# EAGLE design controller (EAGLE 7.6.0)
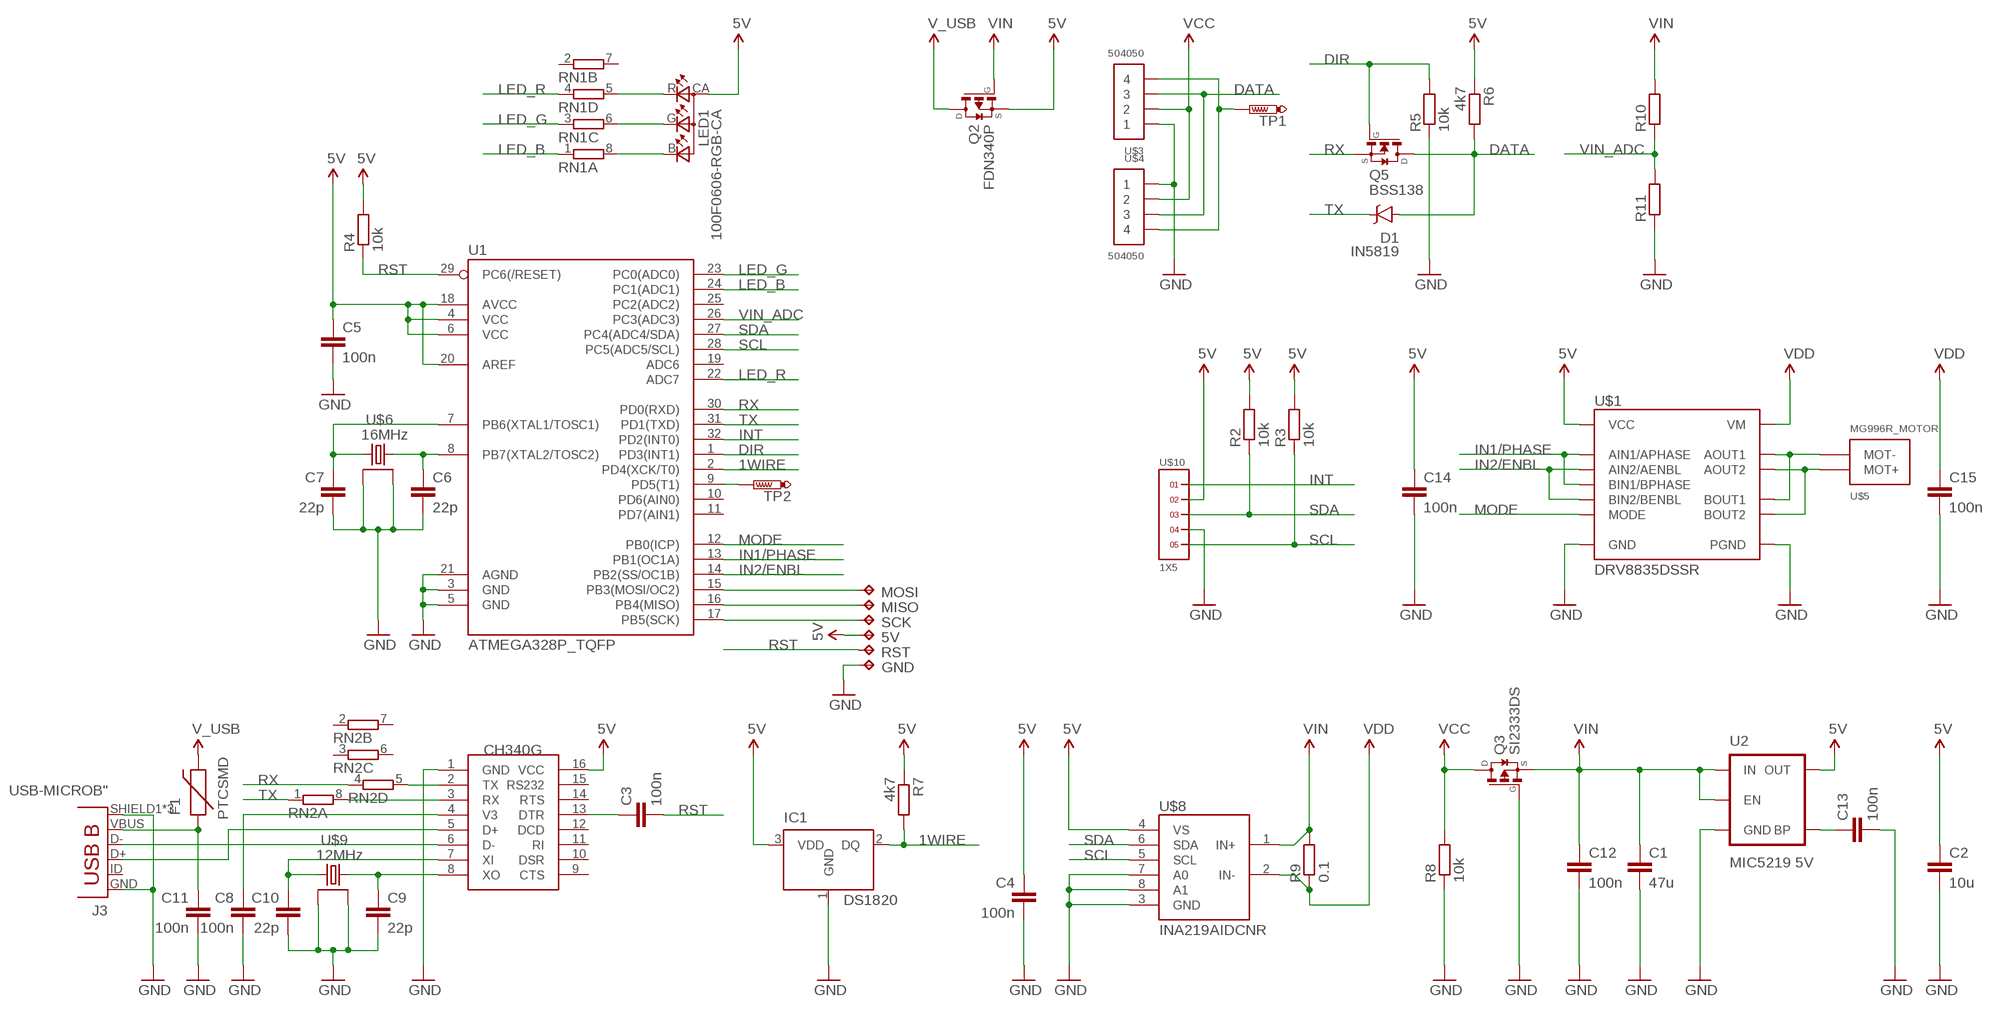
[diagram p0: schematic, sheet 1]

## Parts
5V  TPTP07SQ  [TP07SQ]
C1  47u  C-EUC1206  [C1206]
C2  10u  C-EUC0603K  [C0603K]
C3  100n  C-EUC0402K  [C0402K]
C4  100n  C-EUC0402K  [C0402K]
C5  100n  C-EUC0402K  [C0402K]
C6  22p  C-EUC0402K  [C0402K]
C7  22p  C-EUC0402K  [C0402K]
C8  100n  C-EUC0402K  [C0402K]
C9  22p  C-EUC0402K  [C0402K]
C10  22p  C-EUC0402K  [C0402K]
C11  100n  C-EUC0402K  [C0402K]
C12  100n  C-EUC0402K  [C0402K]
C13  100n  C-EUC0402K  [C0402K]
C14  100n  C-EUC0402K  [C0402K]
C15  100n  C-EUC0402K  [C0402K]
D1  IN5819  MBRA140  [SMA-DIODE]
F1  PTCSMD  [PTC-1206]
GND  TPTP07SQ  [TP07SQ]
IC1  DS1820  [TO-92]
J3  USB-MICROB"  [USB-B-MICRO-SMD_V03]
LED1  100F0606-RGB-CA  [1616]
MISO  TPTP07SQ  [TP07SQ]
MOSI  TPTP07SQ  [TP07SQ]
Q2  FDN340P  [SSOT-3]
Q3  SI2333DS  [SOT23]
Q5  BSS138  [SOT23]
R2  10k  R-EU_R0402  [R0402]
R3  10k  R-EU_R0402  [R0402]
R4  10k  R-EU_R0402  [R0402]
R5  10k  R-EU_R0402  [R0402]
R6  4k7  R-EU_R0402  [R0402]
R7  4k7  R-EU_R0402  [R0402]
R8  10k  R-EU_R0402  [R0402]
R9  0.1  R-EU_R2512  [R2512]
R10  R-EU_R0402  [R0402]
R11  R-EU_R0402  [R0402]
RN1  4R-NYC124  [YC124]
RN2  4R-NYC124  [YC124]
RST  TPTP07SQ  [TP07SQ]
SCK  TPTP07SQ  [TP07SQ]
TP1  PTR1TP12R  [TP12R]
TP2  PTR1TP12R  [TP12R]
U1  ATMEGA328P_TQFP  [TQFP32-08]
U2  MIC5219 5V  V_REG_MIC52195V  [SOT23-5]
U$1  DRV8835DSSR  [WSON-12]
U$2  CH340G  [SOIC16]
U$3  504050  [504050]
U$4  504050  [504050]
U$5  MG996R_MOTOR  [MOTOR]
U$6  16MHz  GSX-331  [OSC3225]
U$8  INA219AIDCNR  [SOT23-8L]
U$9  12MHz  GSX-331  [OSC3225]
U$10  1X5  [1X5]

## Nets
1WIRE: IC1.2(DQ) R7.2 U1.2(PD4(XCK/T0))
5V: 5V.TP C2.1 C4.1 C5.1 C14.1 IC1.3(VDD) LED1.CA Q2.2(S) R2.2 R3.2 R4.2 R6.1 R7.1 U1.4(VCC) U1.6(VCC) U1.18(AVCC) U1.20(AREF) U2.5(OUT) U$1.P$12(VCC) U$2.16(VCC) U$8.4(VS) U$10.2
D+: J3.D+ U$2.5(D+)
D-: J3.D- U$2.6(D-)
DATA: D1.A Q5.3(D) R6.2 U$3.P$3 U$4.P$3
DIR: Q5.1(G) R5.2 U1.1(PD3(INT1))
GND: C1.2 C2.2 C4.2 C5.2 C6.2 C7.2 C8.2 C9.2 C10.2 C11.2 C12.2 C13.2 C14.2 C15.2 GND.TP IC1.1(GND) J3.GND J3.SHIELD1(SHIELD) J3.SHIELD2(SHIELD) J3.SHIELD3(SHIELD) Q3.1(G) R5.1 R8.1 R11.1 U1.3(GND) U1.5(GND) U1.21(AGND) U2.2(GND) U$1.P$6(GND) U$1.P$13(PGND) U$1.P$14(PGND) U$1.P$15(PGND) U$1.P$16(PGND) U$2.1(GND) U$3.P$1 U$4.P$1 U$6.P$2 U$6.P$4 U$8.3(GND) U$8.7(A0) U$8.8(A1) U$9.P$2 U$9.P$4 U$10.4
IN1/PHASE: U1.13(PB1(OC1A)) U$1.P$8(BIN1/BPHASE) U$1.P$10(AIN1/APHASE)
IN2/ENBL: U1.14(PB2(SS/OC1B)) U$1.P$7(BIN2/BENBL) U$1.P$9(AIN2/AENBL)
INT: U1.32(PD2(INT0)) U$10.1
LED_B: RN1.1 U1.24(PC1(ADC1))
LED_B_: LED1.B RN1.8
LED_G: RN1.3 U1.23(PC0(ADC0))
LED_G_: LED1.G RN1.6
LED_R: RN1.4 U1.22(ADC7)
LED_R_: LED1.R RN1.5
MODE: U1.12(PB0(ICP)) U$1.P$11(MODE)
MOT+: U$1.P$2(AOUT1) U$1.P$4(BOUT1) U$5.P$3(MOT-) U$5.P$4(MOT-)
MOT-: U$1.P$3(AOUT2) U$1.P$5(BOUT2) U$5.P$1(MOT+) U$5.P$2(MOT+)
N$1: C6.1 U1.8(PB7(XTAL2/TOSC2)) U$6.P$1
N$2: C7.1 U1.7(PB6(XTAL1/TOSC1)) U$6.P$3
N$3: MOSI.TP U1.15(PB3(MOSI/OC2))
N$4: MISO.TP U1.16(PB4(MISO))
N$5: C3.1 U$2.13(DTR)
N$6: RN2.5 U$2.2(TX)
N$7: TP1.TP U$3.P$4 U$4.P$4
N$8: C10.1 U$2.7(XI) U$9.P$3
N$9: C9.1 U$2.8(XO) U$9.P$1
N$10: C11.1 F1.1 J3.VBUS
N$11: C8.1 U$2.4(V3)
N$12: C13.1 U2.4(BP)
N$13: TP2.TP U1.9(PD5(T1))
N$14: SCK.TP U1.17(PB5(SCK))
N$15: RN2.8 U$2.3(RX)
RST: C3.2 R4.1 RST.TP U1.29(PC6(/RESET))
RX: Q5.2(S) RN2.4 U1.30(PD0(RXD))
SCL: R3.1 U1.28(PC5(ADC5/SCL)) U$8.5(SCL) U$10.5
SDA: R2.1 U1.27(PC4(ADC4/SDA)) U$8.6(SDA) U$10.3
TX: D1.C RN2.1 U1.31(PD1(TXD))
V_USB: F1.2 Q2.3(D)
VCC: Q3.3(D) R8.2 U$3.P$2 U$4.P$2
VDD: C15.1 R9.1 U$1.P$1(VM) U$8.2(IN-)
VIN: C1.1 C12.1 Q2.1(G) Q3.2(S) R9.2 R10.2 U2.1(IN) U2.3(EN) U$8.1(IN+)
VIN_ADC: R10.1 R11.2 U1.26(PC3(ADC3))
Unconnected: J3.ID(USBID) RN1.2 RN1.7 RN2.2 RN2.3 RN2.6 RN2.7 U1.10(PD6(AIN0)) U1.11(PD7(AIN1)) U1.19(ADC6) U1.25(PC2(ADC2)) U$2.9(CTS) U$2.10(DSR) U$2.11(RI) U$2.12(DCD) U$2.14(RTS) U$2.15(RS232)

## Library data of the parts
5V GND MISO MOSI RST SCK = testpad:TP: Test pad
C1-C15 = rcl:C-EU: CAPACITOR, European symbol
D1 = SparkFun-DiscreteSemi:MBRA140: 40V, 1A Schottky rectifier SMA/DO-214AC package DIO-08053; PROD_ID: DIO-08053
F1 = SparkFun-PowerIC:PTC: Resettable Fuse PTC Resettable Fuse. Spark Fun Electronics SKU : COM-08357; PROD_ID: RES-11150
IC1 = DS1820:DS1820: DS1820 - 1-Wire Digital Thermometer
J3 = SparkFun-Connectors:USB-MICROB; PROD_ID: CONN-11752
LED1 = 100F0606-RGB-CA:100F0606-RGB-CA: Common-anode 1616 RGB LED
Q2 = transistor-fet:FDN340P: P-Channel MOSFET Logic Level, PowerTrench MOSFET
Q3 = transistor-fet:SI2333DS: P-Channel MOSFET
Q5 = transistor-fet:BSS138*: Power MOSFET
R2-R11 = rcl:R-EU_: RESISTOR, European symbol
RN1 RN2 = resistor-dil:4R-N: Array Chip Resistor Source: RS Component / Phycomp; OC_FARNELL: unknown; OC_NEWARK: unknown
TP1 TP2 = testpad:PTR1: TEST PIN
U1 = SparkFun-DigitalIC:ATMEGA328P_TQFP; PROD_ID: IC-09069
U2 = SparkFun-PowerIC:V_REG_MIC5219: V_REG MIC5219 Standard 3.3V and 5V 500mA LDO voltage regulator in SOT-23 layout. Micrel part MIC5219. BP (by-pass) pin is used to lower output noise with 470pF cap, may be left open.; PROD_ID: VREG-10107
U$1 = DRV8835:DRV8835DSSR
U$2 = ch340g:CH340G
U$3 U$4 = con-molex-picolock:504050
U$5 = MG996R-Motor:MG996R_MOTOR
U$6 U$9 = crystals_golledge_full_v1-0:GSX-331: Crystal |SM| 3.2 x 2.5 mm | AT cut | Frequency Range 10 - 125 MHz Metal lid can be grounded to minimise EMI Seam sealed for excellent long-term stability Tight specifications available Ultra-miniature for maximum space saving Datasheet <http://www.golledge.com/docs/products/xtl_sm/gsx331.htm?src=eagle>; HEIGHT: 0.8
U$8 = INA219AIDCNR:INA219AIDCNR
U$10 = headers(.05in):1X5

## Board
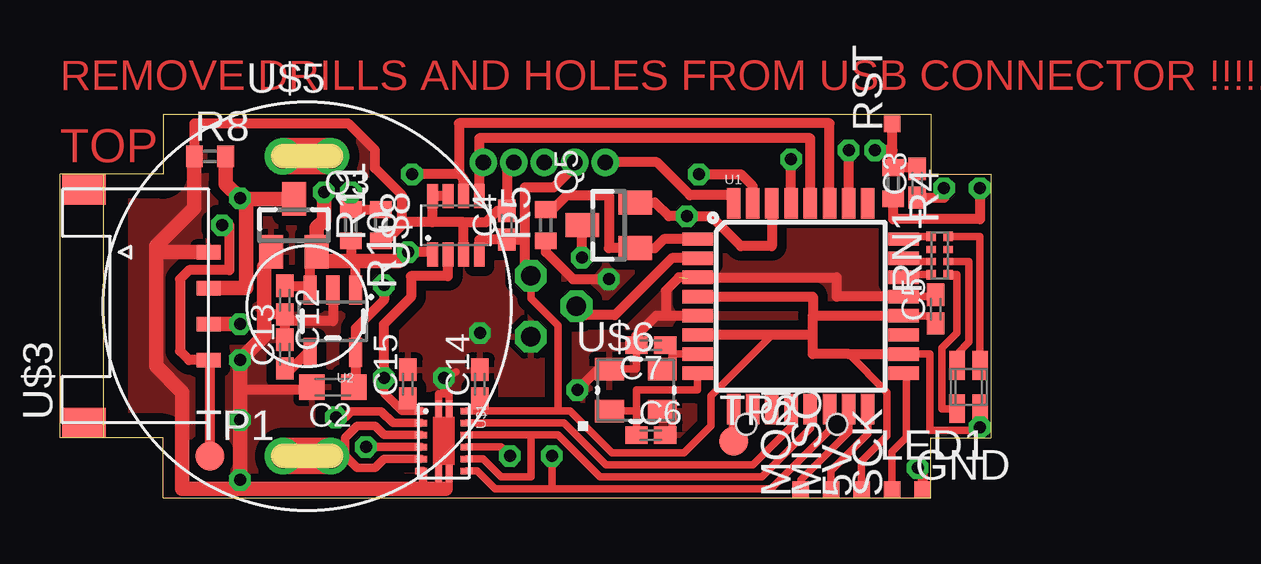
[diagram p1: board, top side]
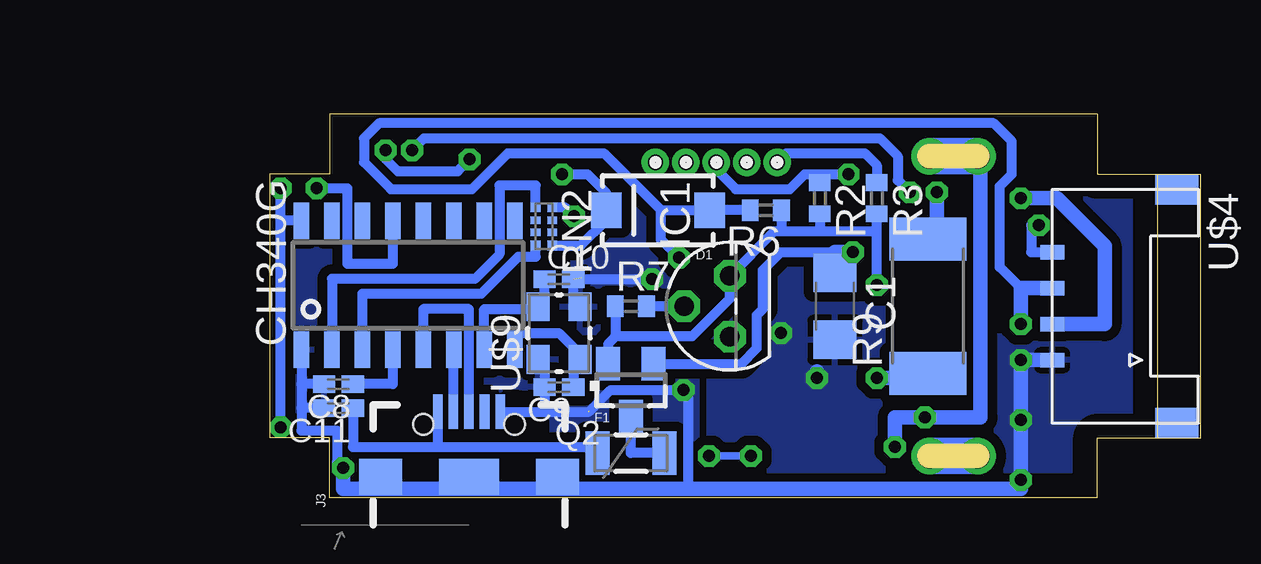
[diagram p2: board, bottom side, seen from below]

Size 38.8 x 16 mm. Coordinates in mm from the lower left corner, seen from the top.
Outline: 1.8,13.5 4.3,13.5 4.3,16 36.3,16 36.3,13.5 38.8,13.5 38.8,2.5 36.3,2.5 36.3,0 4.3,0 4.3,2.5 1.8,2.5
Outline: 1.8,13.5 0,13.5 0,2.5 1.8,2.5
Outline: 1.8,13.5 1.8,2.5
Copper layers (1*16): Top 0.035mm / dielectric 1.5mm / Bottom 0.035mm
Design rules "default": minimum track width 10mil, minimum drill 24mil, track to track 8mil, track to pad 8mil, pad to pad 8mil, via to via 8mil, smd to smd 8mil, copper to edge 40mil, drill to drill 8mil, minimum pad ring 10mil, minimum via ring 8mil, stop-mask expansion 4mil, vias tented up to drill 0mil, thermal gap 10mil

### Footprints (pad centres in the part's own frame; a part is rotated, then mirrored left to right if it is on the bottom)
TP07SQ = smd 0.7 x 0.7: TP 0,0
C1206 = smd 1.6 x 1.8: 1 -1.4,0; 2 1.4,0
C0603K = smd 1.05 x 1.08: 1 -0.875,0; 2 0.875,0
C0402K = smd 0.925 x 0.74: 1 -0.6,0; 2 0.6,0
SMA-DIODE = smd 1.27 x 1.47: A -2.15,0; C 2.15,0
PTC-1206 = smd 1 x 1.8: 1 -1.4,0; 2 1.4,0
TO-92 = drill 0.813 pad 1.27 octagon: 1 -1.27,0; 2 0,1.905; 3 1.27,0
USB-B-MICRO-SMD_V03 = smd 1.45 x 0.4: D+ 2.725,0; D- 2.725,0.65; GND 2.725,-1.3; ID 2.725,-0.65; VBUS 2.725,1.3 | smd 1.5 x 1.8: SHIELD1 0,3.685; SHIELD2 0,-3.685 | smd 1.5 x 2.5: SHIELD3 0,0 | hole 0.85: 2.2,1.9; 2.2,-1.9
1616 = smd 0.65 x 1.2: B -0.475,-0.9; CA -0.475,0.9; G 0.475,-0.9; R 0.475,0.9
SSOT-3 = smd 1 x 1.4: 1 -0.95,-1.1; 2 0.95,-1.1; 3 0,1.1
SOT23 = smd 1 x 1.4: 1 -0.95,-1.1; 2 0.95,-1.1; 3 0,1.1
R0402 = smd 0.7 x 0.9: 1 -0.65,0; 2 0.65,0
R2512 = smd 1.8 x 3.2: 1 -2.8,0; 2 2.8,0
YC124 = smd 0.4 x 0.4: 1 -0.8,-0.35; 4 0.8,-0.35; 5 0.8,0.35; 8 -0.8,0.35 | smd 0.3 x 0.4: 2 -0.25,-0.35; 3 0.25,-0.35; 6 0.25,0.35; 7 -0.25,0.35
TP12R = smd 1.2 x 1.2: TP 0,0
TQFP32-08 = smd 1.27 x 0.559: 1 -4.293,2.8; 2 -4.293,2; 3 -4.293,1.2; 4 -4.293,0.4; 5 -4.293,-0.4; 6 -4.293,-1.2; 7 -4.293,-2; 8 -4.293,-2.8; 17 4.293,-2.8; 18 4.293,-2; 19 4.293,-1.2; 20 4.293,-0.4; 21 4.293,0.4; 22 4.293,1.2; 23 4.293,2; 24 4.293,2.8 | smd 0.559 x 1.27: 9 -2.8,-4.293; 10 -2,-4.293; 11 -1.2,-4.293; 12 -0.4,-4.293; 13 0.4,-4.293; 14 1.2,-4.293; 15 2,-4.293; 16 2.8,-4.293; 25 2.8,4.293; 26 2,4.293; 27 1.2,4.293; 28 0.4,4.293; 29 -0.4,4.293; 30 -1.2,4.293; 31 -2,4.293; 32 -2.8,4.293
SOT23-5 = smd 0.55 x 1.2: 1 -0.95,-1.3; 2 0,-1.3; 3 0.95,-1.3; 4 0.95,1.3; 5 -0.95,1.3
WSON-12 = smd 0.28 x 0.5: P$1 -1.25,-0.95; P$2 -0.75,-0.95; P$3 -0.25,-0.95; P$4 0.25,-0.95; P$5 0.75,-0.95; P$6 1.25,-0.95; P$7 1.25,0.95; P$8 0.75,0.95; P$9 0.25,0.95; P$10 -0.25,0.95; P$11 -0.75,0.95; P$12 -1.25,0.95 | smd 0.7 x 0.25: P$13 -1.35,0.225; P$14 -1.35,-0.225; P$15 1.35,-0.225; P$16 1.35,0.225
SOIC16 = smd 0.635 x 1.524: 1 -4.445,-2.695; 2 -3.175,-2.695; 3 -1.905,-2.695; 4 -0.635,-2.695; 5 0.635,-2.695; 6 1.905,-2.695; 7 3.175,-2.695; 8 4.445,-2.695; 9 4.445,2.695; 10 3.175,2.695; 11 1.905,2.695; 12 0.635,2.695; 13 -0.635,2.695; 14 -1.905,2.695; 15 -3.175,2.695; 16 -4.445,2.695
504050 = smd 0.6 x 1: P$1 2.25,0.01; P$2 0.75,0.01; P$3 -0.75,0.01; P$4 -2.25,0.01 | smd 1.25 x 1.8: P$5 4.855,5.2; P$6 -4.855,5.2
MOTOR = drill 1.016: P$1 1,-6.25; P$2 -1,-6.25; P$3 1,6.25; P$4 -1,6.25
OSC3225 = smd 1.2 x 0.95: P$1 -1.1,-0.875; P$2 1.1,-0.875; P$3 1.1,0.875; P$4 -1.1,0.875
SOT23-8L = smd 0.45 x 1: 1 -0.975,-1.225; 2 -0.325,-1.225; 3 0.325,-1.225; 4 0.975,-1.225; 5 0.975,1.225; 6 0.325,1.225; 7 -0.325,1.225; 8 -0.975,1.225
1X5 = drill 0.635 pad 1.016: 1 0,0; 2 1.27,0; 3 2.54,0; 4 3.81,0; 5 5.08,0

### Placement (x,y rotation side)
5V  33.41,0.35 90 top
C1  15.25,8 270 bottom
C2  11.38,4.62 180 top
C3  35.73,13.12 90 top
C4  18.62,11.38 90 top
C5  36.5,7.88 90 top
C6  24.62,2.62 0 top
C7  24.62,6.38 180 top
C8  35.94,4.75 180 bottom
C9  26.75,4.62 180 bottom
C10  26.75,9.12 0 bottom
C11  35.94,3.75 180 bottom
C12  9.38,8.25 270 top
C13  9.38,6 90 top
C14  17.5,4.75 90 top
C15  14.5,4.75 90 top
D1  22.62,12 180 bottom
F1  23.75,1.88 0 bottom
GND  35.95,0.35 0 top
IC1  19.62,8 90 bottom
J3  30.5,0.88 90 bottom
LED1  37.88,4.62 180 top
MISO  32.15,0.35 90 top
MOSI  30.88,0.35 90 top
Q2  23.75,4.5 180 bottom
Q3  9.75,11.38 0 top
Q5  22.88,11.38 90 top
R2  15.88,12.5 270 bottom
R3  13.5,12.5 270 bottom
R4  34.73,13.12 270 top
R5  20.25,11.38 90 top
R6  18.12,12 180 bottom
R7  23.75,8 0 bottom
R8  6.25,14.25 0 top
R9  11.38,8 90 bottom
R10  12.12,11.38 270 top
R11  13.38,11.38 90 top
RN1  36.66,10.12 270 top
RN2  27.38,11.33 90 bottom
RST  34.69,15.6 90 top
SCK  34.69,0.35 90 top
TP1  6.25,1.75 0 top
TP2  28.07,2.38 0 top
U1  30.88,8 0 top
U2  11.38,7.38 180 top
U$1  16,2.38 270 top
U$2  33.04,8.88 0 bottom
U$3  6.2,8 90 top
U$4  6.2,8 270 bottom
U$5  10.3,8 0 top
U$6  24,4.5 0 top
U$8  16.5,11.38 0 top
U$9  26.75,6.88 90 bottom
U$10  22.73,14 0 bottom

### Tracks (layer width: path | path; a pad name or v marks a point on that pad's centre or on a via)
1WIRE
  Top 0.406: U1.2 25.5,10 23.12,7.62 21.91,7.62 IC1.2
  Bottom 0.406: R7.2 IC1.2
5V  (via drill 0.5)
  Top 0.305: 20.75,3.62 21.25,3.62 23,1.88 26,1.88 27.12,3 27.12,4.25 29.62,6.75 29.62,6.8 | 20.75,3.62 17.5,3.62 | 17.5,3.62 U$1.P$12 | C14.1 17.5,3.62 | 5V.TP 33.41,1.54 34.48,2.6 34.48,4.4 32.88,6 | U1.20 36.5,7.6 C5.1 | U1.18 36.25,6 36.25,2.81 38.2,2.81 v38.34,2.96 LED1.CA | IC1.3 19.62,8.31 20.75,7.19 20.75,3.62
  Top 0.406: C2.1 12.32,4.62 U2.5 12.32,7.08 13.5,8.25 v13.5,8.88 | 19.38,10.78 C4.1 17.48,10.78 U$8.4 | v38.34,12.92 38.34,11.62 34.73,11.62 R4.2 | IC1.3 19.38,9.52 19.38,10.78 | U1.4 31.38,8.4 31.38,7.6 | U1.20 31.38,7.6 | 31.38,6.8 31.38,6 32.88,6 U1.18 | 31.38,6.8 31.38,7.6 | 31.38,6.8 29.62,6.8 U1.6 | U$10.2 21.46,13.84 20.59,12.96 19.38,12.96 19.38,10.78
  Bottom 0.406: 17.48,11.12 17.77,11.12 IC1.3 | 17.48,11.12 15.88,11.12 | 15.88,11.12 13.5,11.12 | v13.5,8.88 13.5,11.12 | R2.2 15.88,11.12 | 13.5,11.12 R3.2 | 19.64,9.25 IC1.3 | v38.34,2.96 38.34,11.57 | 38.34,11.57 v38.34,12.92 | Q2.2 24.7,6.42 24.38,6.75 | U$2.16 38.34,11.57 | 24.38,6.75 21.19,6.75 19.62,8.31 IC1.3 | R7.1 24.4,6.78 24.38,6.75 | R6.1 17.48,11.12
D+
  Bottom 0.406: J3.D+ 30.5,7.88 32.41,7.88 U$2.5
D-
  Bottom 0.406: J3.D- 31.15,5.68 U$2.6
DATA  (via drill 0.5)
  Top 0.406: v21.75,10.03 21.75,11.38 Q5.3
  Top 0.61: v7.5,7.25 U$3.P$3
  Bottom 0.406: 7.5,8.75 8.38,9.62 8.38,13 7.88,13.5 7.88,14.88 8.62,15.62 34.25,15.62 34.88,15 34.88,14 33.75,12.88 30.38,12.88 28.88,14.38 24.88,14.38 22.5,12 | 20.75,12 D1.A | 22.5,12 D1.A | R6.2 D1.A | v21.75,10.03 22.5,10.78 22.5,12
  Bottom 0.61: U$4.P$3 7.5,8.75 v7.5,7.25 7.62,7.25
DIR
  Top 0.406: R5.2 20.52,12.03 21.12,12.62 22.88,12.62 22.88,10.43 Q5.1 24.8,10.43 25.18,10.8 U1.1
GND  (via drill 0.5)  (2 unrouted)
  Top 0.305: U$1.P$15 U$1.P$14 15.78,4.35 16,4.35 | U$1.P$16 U$1.P$13 16.23,4.35 16,4.35 | 16,4.35 v16,5 16.5,5.25 | U$1.P$15 15.78,0.38 16.06,0.38 16.23,0.38 16.23,1 | 15.78,1.12 U$1.P$15 | U1.21 36.5,8.4 C5.2 | U$6.P$2 25.5,3.62 25.5,2.62 C6.2 | C7.2 24.02,5.38 U$6.P$4
  Top 0.35: U$1.P$6 15.12,1.12 15.12,0.38
  Top 0.406: R8.1 5.6,15.62 12,15.62 13.12,14.5 13.12,13.75 14.25,12.62 14.25,11.5 | U$8.3 16.82,11.5 | U$8.7 U$8.8 15.53,11.5 | 16.82,11.5 17.75,11.5 18.23,11.97 C4.2 18.62,13.71 U$10.4 | U2.2 11.38,7.38 9.38,7.38 C12.2 | C13.2 C12.2 | C2.2 10.5,4.5 7.5,4.5 v7.5,3.25 | v35.75,1.25 35.95,1.25 GND.TP | C12.2 8.5,7.65 | 16.82,11.5 15.53,11.5 | 15.53,11.5 14.25,11.5 | U1.21 32.38,8.4 32.38,9.2 U1.3 25.8,9.2 25.25,8.65 25.25,7.6 | v21.56,4.5 22.44,5.38 U$6.P$4 | U1.5 25.25,7.6 | 25.25,7.6 24.85,7.6 24.02,6.78 C7.2 | R5.1 20.25,10.25 21.38,9.12 v22.88,9.12 | R11.1 13.6,10.72 14.25,11.38 14.25,11.5
  Top 0.61: 4,10.25 4,5.5 5.1,4.4 5.1,0.38 7.5,0.38 | Q3.1 8.8,9.95 8.5,9.65 8.5,7.65 8.5,6.75 v7.5,5.75 v7.5,3.25 7.5,0.38 | 7.5,0.38 15.12,0.38 16.06,0.38 | U$3.P$1 4,10.25 | 4,10.25 4,10.5 5.6,12.1 R8.1
  Bottom 0.406: 21.38,0.38 21.38,4.5 v21.56,4.5 24.6,4.5 25.5,3.6 27.38,3.6 | U$2.1 37.48,4.75 | 37.48,3.75 37.48,2.81 36,2.81 36,1.5 v35.75,1.25 | U$9.P$4 27.35,5.5 C9.2 27.35,3.62 27.38,3.6 | U$9.P$2 26.15,8.25 C10.2 v22.88,9.12 | J3.GND 27.38,3.6 | C8.2 37.48,4.75 | 37.48,4.75 37.48,3.75 | C11.2 37.48,3.75
  Bottom 0.61: U$4.P$1 v7.5,5.75 v7.5,3.25 v7.5,0.75 7.5,0.38 21.38,0.38 27,0.38 | 16,5.28 v16,5 | v35.75,1.25 35.75,0.38 34.5,0.38 | 34.5,0.38 30.75,0.38 | 30.75,0.38 27,0.38 | J3.SHIELD2 26.94,0.43 27,0.38 | J3.SHIELD3 30.62,0.5 30.75,0.38 | J3.SHIELD1 34.31,0.56 34.5,0.38
  other vias: 17.5,6.88
  pour Bottom (isolate 0.406): 13.25,0 13.25,10 20.5,10 20.5,0
  pour Top (isolate 0.406): 13.25,10 13.25,0 20.5,0 20.5,10
  pour Top (isolate 0.406): 0,16 12.75,16 12.75,0 0,0
  pour Bottom (isolate 0.406): 12.75,0 0,0 0,16 12.75,16
  pour Bottom (isolate 0.406): 21,0 21,16 38.8,16 38.8,0
  pour Top (isolate 0.406): 21,0 38.8,0 38.8,16 21,16
IN1/PHASE
  Top 0.305: U$1.P$10 19.62,2.62 | 19.62,2.62 20.75,2.62 22.5,0.88 29.25,0.88 31.27,2.9 U1.13 | U$1.P$8 17.62,1.62 18.38,0.88 19.62,0.88 19.62,2.62
IN2/ENBL  (via drill 0.5)
  Top 0.305: U$1.P$9 18.38,2.12 v18.75,1.75 | U$1.P$7 17.38,1.12 18.12,0.38 20.5,0.38 | U1.14 32.08,2.83 29.62,0.38 20.5,0.38 | v20.5,1.75 20.5,0.38
  Bottom 0.305: v18.75,1.75 v20.5,1.75
INT
  Top 0.406: U1.32 28.07,12.62 26.25,12.62 24.88,14 U$10.1
LED_B
  Top 0.305: U1.24 35.17,10.91 RN1.1
LED_B_
  Top 0.305: LED1.B 38.35,10.91 RN1.8
LED_G
  Top 0.305: U1.23 35.17,9.87 RN1.3
LED_G_
  Top 0.305: LED1.G 37.4,6 37.88,6.5 37.88,9.87 RN1.6
LED_R
  Top 0.305: U1.22 35.17,9.31 RN1.4
LED_R_
  Top 0.305: LED1.R 36.75,3.73 36.75,6.25 37.38,6.88 37.38,9.31 RN1.5
MODE
  Top 0.305: U$1.P$11 21,3.12 22.75,1.38 28.88,1.38 30.48,2.98 U1.12
MOT+  (via drill 0.5)
  Top 0.35: U$1.P$4 v12.75,2.12 | U$1.P$2 13.88,3.12 13.39,3.61 12.12,3.61 11.88,3.36 v11.5,3.36
  Bottom 0.61: v12.75,2.12 12.75,3.36 v11.5,3.36 9.18,3.36 9.18,14.25 U$5.P$3
MOT-
  Top 0.35: U$1.P$3 13.5,2.62 13.12,3 12.38,3 11.88,2.5 11.88,1.75 | 11.88,1.75 12.38,1.25 13.12,1.25 13.5,1.62 U$1.P$5 | 11.88,1.75 U$5.P$1
N$1
  Top 0.305: C6.1 24.02,3.62 | 24.02,3.62 U$6.P$1 | U1.8 26.58,4.5 24.02,4.5 24.02,3.62
N$2
  Top 0.305: U1.7 25.5,6 | 25.5,6 25.5,6.38 C7.1 | U$6.P$3 25.5,5.38 25.5,6
N$3
  Top 0.305: U1.15 32.88,2.75 30.88,0.75 MOSI.TP
N$4
  Top 0.305: U1.16 33.67,2.67 32.15,1.15 MISO.TP
N$5  (via drill 0.5)
  Top 0.406: C3.1 36.85,12.53 v36.85,12.92
  Bottom 0.406: 33.67,11.8 U$2.13 33.67,9.78 35.58,9.78 35.58,12.92 v36.85,12.92
N$6
  Bottom 0.406: U$2.2 36.22,9.14 30.25,9.14 29.23,10.16 29.23,13.04 27.73,13.04 RN2.5
N$7  (via drill 0.5)
  Top 0.406: v6.75,11.38 7.06,11.38 7.06,9.5 5.38,9.5 5,9.12 5,6.12 5.38,5.75 U$3.P$4 6.25,5.75 TP1.TP
  Bottom 0.406: v6.75,11.38 7.06,11.38 7.06,10.25 U$4.P$4
N$8
  Bottom 0.406: C10.1 27.35,8.25 U$9.P$3 27.62,7.88 29.86,7.88 U$2.7
N$9
  Bottom 0.406: C9.1 26.15,5.5 U$9.P$1 25.88,6 26.75,6.88 28.59,6.88 U$2.8
N$10
  Bottom 0.406: 31.8,2.12 35.34,2.12 C11.1 | 31.8,2.12 25.15,2.12 F1.1 | 31.8,4.12 J3.VBUS 31.8,2.12
N$11
  Bottom 0.406: U$2.4 33.67,4.75 C8.1
N$12
  Top 0.406: C13.1 9.65,5.4 10.32,6.08 U2.4
N$13
  Top 0.406: U1.9 TP2.TP
N$14
  Top 0.305: SCK.TP 34.69,1.94 35.27,2.52 35.27,5.2 U1.17
N$15
  Bottom 0.406: U$2.3 34.95,8.51 29.99,8.51 28.44,10.06 27.73,10.06 RN2.8
RST  (via drill 0.5)
  Top 0.406: U1.29 v30.48,14.12 | C3.2 35.73,13.78 R4.1 34.7,13.78 34.7,14.5 | 34.7,14.5 v33.98,14.5 | 34.7,14.5 RST.TP
  Bottom 0.406: v33.98,14.5 33.98,14.12 33.48,13.62 30.98,13.62 v30.48,14.12
RX  (via drill 0.5)
  Top 0.406: v26.12,11.75 27.12,11.75 28.38,10.5 29.68,10.5 U1.30 | v26.12,11.75 25.88,11.75 | Q5.2 24.8,12.32 25.38,11.75 v26.12,11.75
  Bottom 0.406: RN2.4 26.5,12.13 v26.12,11.75
SCL
  Top 0.406: U1.28 31.27,15 17.48,15 17.48,14 | 17.48,14 U$8.5 | U$10.5 17.48,14
  Bottom 0.406: R3.1 13.5,13.88 14,14.38 17.27,14.38 U$10.5
SDA  (via drill 0.5)
  Top 0.406: U1.27 32.08,15.62 16.62,15.62 16.62,13.5 | U$8.6 16.82,13.3 16.62,13.5 | 16.62,13.5 v14.68,13.5
  Bottom 0.406: 15.88,13.5 16.5,13.5 17.12,12.88 19.38,12.88 20.19,13.69 U$10.3 | 15.88,13.5 v14.68,13.5 | R2.1 15.88,13.5
TX  (via drill 0.5)
  Top 0.406: U1.31 28.88,13 28.38,13.5 v26.62,13.5
  Bottom 0.406: D1.C 25.15,11.75 | D1.C 24.77,12.71 25.56,13.5 v26.62,13.5 | D1.C 24.77,11.79 | RN2.1 25.84,10.53 24.77,11.6 D1.C
V_USB
  Bottom 0.406: F1.2 23.75,1.88 Q2.3
VCC  (via drill 0.5)
  Top 0.61: U$3.P$2 7.75,8.75 7.75,12.47 | 7.75,12.47 Q3.3 | 7.75,12.47 7.75,12.5 v7.5,12.5 6.9,13.1 R8.2
  Bottom 0.61: U$4.P$2 4,7.25 4,10.5 6,12.5 v7.5,12.5
VDD  (via drill 0.5)
  Top 0.35: U$1.P$1 14.5,3.62 | 14.5,3.62 14.25,3.62 13.5,4.38 v13.5,5 | C15.1 14.5,3.62
  Top 0.406: v13.5,5 13.5,7.25 14.62,8.38 14.62,9.25 16.18,9.25 U$8.2
  Bottom 0.61: v13.5,5 11.38,5 R9.1
VIN  (via drill 0.5)
  Top 0.406: U$8.1 15.53,10.25 v14.5,10.25 | R10.2 12.12,9.88 11.75,9.88 10.43,9.88 10.43,8.85 | U2.1 12.32,9.88 12.25,9.88 | U2.3 10.43,8.85 | C12.1 10.43,8.85
  Top 0.61: v11,12.75 11,11.57 10.7,11.28 Q3.2 | 10.7,10.05 Q3.2 | v14.5,10.25 14.12,9.88 12.25,9.88 11.75,9.88 10.7,9.88 Q3.2
  Bottom 0.406: 15.25,10.25 17.5,10.25 18.25,9.5 18.25,7.88 18.5,7.62 18.5,6.25 19.15,5.6 Q2.1
  Bottom 0.61: R9.2 11,11.43 v11,12.75 | v14.5,10.25 15.25,10.25 C1.1
VIN_ADC  (via drill 0.5)
  Top 0.406: U1.26 v32.88,14.5 | R11.2 R10.1 v12.12,12.75
  Bottom 0.406: v12.12,12.75 12.62,13.25 12.62,14.25 13.38,15 32.38,15 v32.88,14.5

### Text on the board
Top: REMOVE DRILLS AND HOLES FROM USB CONNECTOR !!!!! | TOP